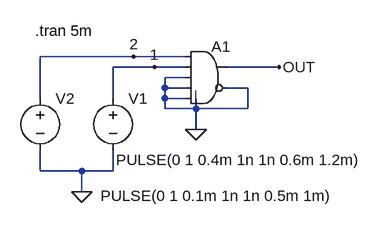
[diagram p0: schematic Fig_2-153_Logic_AND.asc]
Fig_2-153_Logic_AND.asc, the LTspice schematic file:
Version 4
SHEET 1 880 680
WIRE 80 160 -64 160
WIRE 160 160 80 160
WIRE 112 176 48 176
WIRE 160 176 112 176
WIRE 304 176 224 176
WIRE 160 192 128 192
WIRE 128 208 128 192
WIRE 160 208 128 208
WIRE 256 208 224 208
WIRE -64 224 -64 160
WIRE 48 224 48 176
WIRE 128 224 128 208
WIRE 160 224 128 224
WIRE 128 240 128 224
WIRE 176 240 176 224
WIRE 176 240 128 240
WIRE 256 240 256 208
WIRE 256 240 176 240
WIRE 176 272 176 240
WIRE -64 336 -64 304
WIRE 0 336 -64 336
WIRE 48 336 48 304
WIRE 48 336 0 336
WIRE 0 368 0 336
FLAG 176 272 0
FLAG 304 176 OUT
FLAG 0 368 0
FLAG 80 160 2
FLAG 112 176 1
SYMBOL voltage 48 208 R0
WINDOW 3 5 111 Left 2
WINDOW 123 0 0 Left 2
WINDOW 39 0 0 Left 2
SYMATTR Value PULSE(0 1 0.4m 1n 1n 0.6m 1.2m)
SYMATTR InstName V1
SYMBOL voltage -64 208 R0
WINDOW 3 93 166 Left 2
WINDOW 123 0 0 Left 2
WINDOW 39 0 0 Left 2
SYMATTR Value PULSE(0 1 0.1m 1n 1n 0.5m 1m)
SYMATTR InstName V2
SYMBOL Digital\\and 192 128 R0
SYMATTR InstName A1
TEXT -72 120 Left 2 !.tran 5m

The netlist it stands for:
* Fig_2-153_Logic_AND.asc
V1 1 0 PULSE(0 1 0.4m 1n 1n 0.6m 1.2m)
V2 2 0 PULSE(0 1 0.1m 1n 1n 0.5m 1m)
A1 2 1 0 0 0 0 OUT 0 AND
.tran 5m
.backanno
.end